# Altium schematic sheet Sheet1.SchDoc
size 381 x 241 mm; SheetNumber: 1; SheetTotal: 1
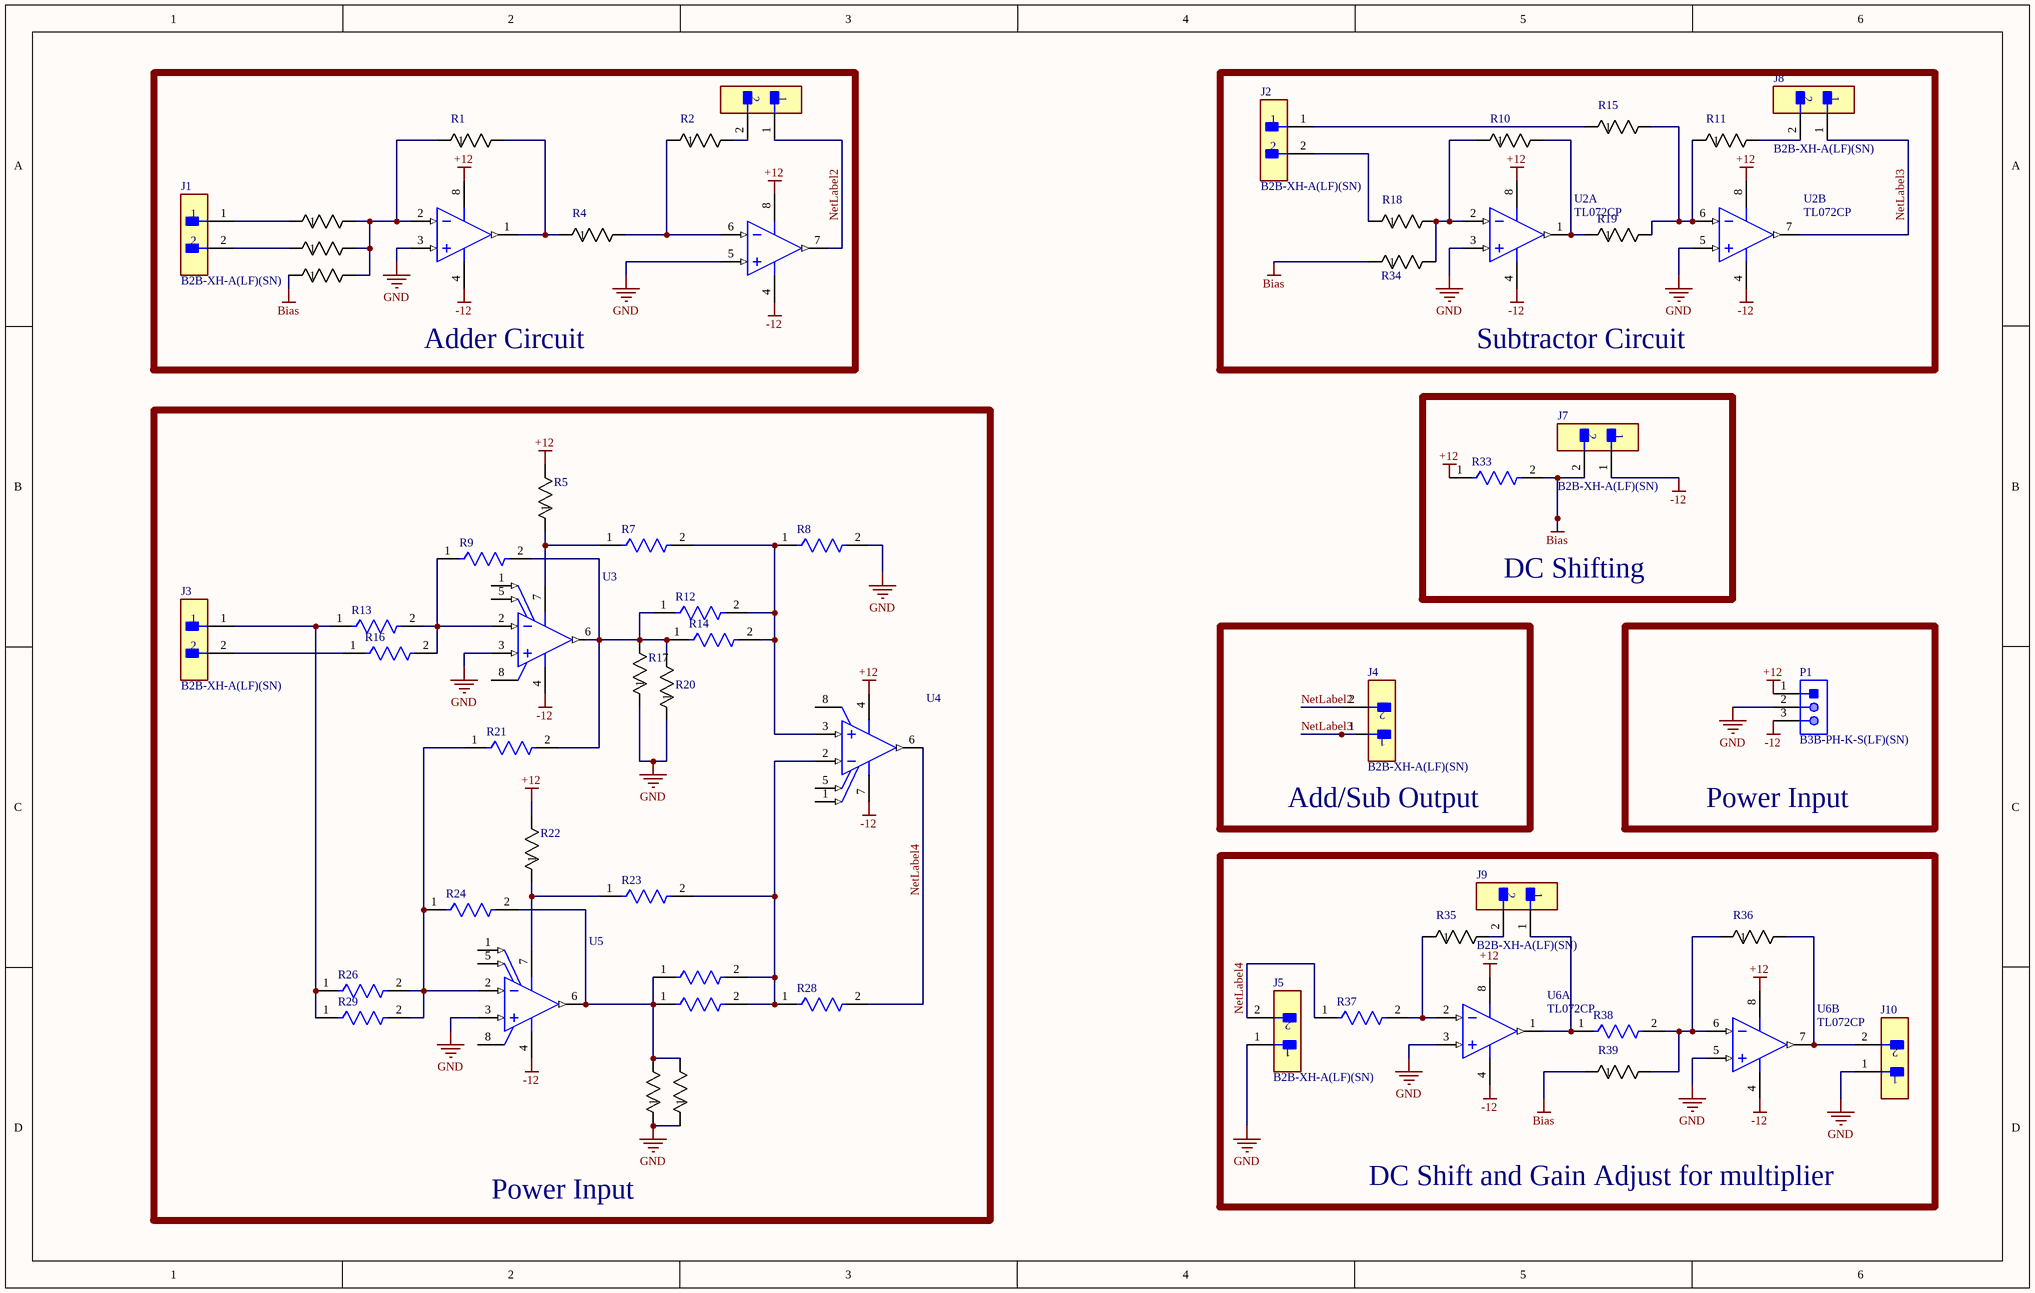
[diagram p0: Sheet1.SchDoc]

## Parts
J1  B2B-XH-A(LF)(SN)  [FP-B2B-XH-A_LF_SN-MFG]
J2  B2B-XH-A(LF)(SN)  [FP-B2B-XH-A_LF_SN-MFG]
J3  B2B-XH-A(LF)(SN)  [FP-B2B-XH-A_LF_SN-MFG]
J4  B2B-XH-A(LF)(SN)  [FP-B2B-XH-A_LF_SN-MFG]
J5  B2B-XH-A(LF)(SN)  [FP-B2B-XH-A_LF_SN-MFG]
J6  B2B-XH-A(LF)(SN)  [FP-B2B-XH-A_LF_SN-MFG]  (value not drawn)
J7  B2B-XH-A(LF)(SN)  [FP-B2B-XH-A_LF_SN-MFG]
J8  B2B-XH-A(LF)(SN)  [FP-B2B-XH-A_LF_SN-MFG]
J9  B2B-XH-A(LF)(SN)  [FP-B2B-XH-A_LF_SN-MFG]
J10  B2B-XH-A(LF)(SN)  [FP-B2B-XH-A_LF_SN-MFG]  (value not drawn)
P1  B3B-PH-K-S(LF)(SN)  [JST-B3B-PH-K-S-3_V]
R1  AC03000004701JAC00  [RES_AC03_VIS]  (value not drawn)
R2  AC03000004701JAC00  [RES_AC03_VIS]  (value not drawn)
R3  AC03000004701JAC00  [RES_AC03_VIS]  (value not drawn)
R4  AC03000004701JAC00  [RES_AC03_VIS]  (value not drawn)
R5  AC03000002201JAC00  [RES_AC03_VIS]  (value not drawn)
R6  AC03000004701JAC00  [RES_AC03_VIS]  (value not drawn)
R7  PR02000201003JA100  [FP-PR02000201003JA100-MFG]  (value not drawn)
R8  PR02000201003JA100  [FP-PR02000201003JA100-MFG]  (value not drawn)
R9  PR02000201003JA100  [FP-PR02000201003JA100-MFG]  (value not drawn)
R10  AC03000004701JAC00  [RES_AC03_VIS]  (value not drawn)
R11  AC03000004701JAC00  [RES_AC03_VIS]  (value not drawn)
R12  PR02000201003JA100  [FP-PR02000201003JA100-MFG]  (value not drawn)
R13  PR02000201003JA100  [FP-PR02000201003JA100-MFG]  (value not drawn)
R14  PR02000201003JA100  [FP-PR02000201003JA100-MFG]  (value not drawn)
R15  AC03000004701JAC00  [RES_AC03_VIS]  (value not drawn)
R16  PR02000201003JA100  [FP-PR02000201003JA100-MFG]  (value not drawn)
R17  AC03000004701JAC00  [RES_AC03_VIS]  (value not drawn)
R18  AC03000004701JAC00  [RES_AC03_VIS]  (value not drawn)
R19  AC03000004701JAC00  [RES_AC03_VIS]  (value not drawn)
R20  AC03000004701JAC00  [RES_AC03_VIS]  (value not drawn)
R21  PR02000201003JA100  [FP-PR02000201003JA100-MFG]  (value not drawn)
R22  AC03000002201JAC00  [RES_AC03_VIS]  (value not drawn)
R23  PR02000201003JA100  [FP-PR02000201003JA100-MFG]  (value not drawn)
R24  PR02000201003JA100  [FP-PR02000201003JA100-MFG]  (value not drawn)
R25  PR02000201003JA100  [FP-PR02000201003JA100-MFG]  (value not drawn)
R26  PR02000201003JA100  [FP-PR02000201003JA100-MFG]  (value not drawn)
R27  PR02000201003JA100  [FP-PR02000201003JA100-MFG]  (value not drawn)
R28  PR02000201003JA100  [FP-PR02000201003JA100-MFG]  (value not drawn)
R29  PR02000201003JA100  [FP-PR02000201003JA100-MFG]  (value not drawn)
R30  AC03000004701JAC00  [RES_AC03_VIS]  (value not drawn)
R31  AC03000004701JAC00  [RES_AC03_VIS]  (value not drawn)
R32  AC03000004701JAC00  [RES_AC03_VIS]  (value not drawn)
R33  PR02000201003JA100  [FP-PR02000201003JA100-MFG]  (value not drawn)
R34  AC03000004701JAC00  [RES_AC03_VIS]  (value not drawn)
R35  AC03000004701JAC00  [RES_AC03_VIS]  (value not drawn)
R36  AC03000004701JAC00  [RES_AC03_VIS]  (value not drawn)
R37  PR02000201003JA100  [FP-PR02000201003JA100-MFG]  (value not drawn)
R38  PR02000201003JA100  [FP-PR02000201003JA100-MFG]  (value not drawn)
R39  AC03000004701JAC00  [RES_AC03_VIS]  (value not drawn)
U1  TL072CP  [P0008A]  (value not drawn)  (parts A,B of 2)
U2  TL072CP  [P0008A]  (parts A,B of 2)
U3  UA741CP  [P0008A]  (value not drawn)
U4  UA741CP  [P0008A]  (value not drawn)
U5  UA741CP  [P0008A]  (value not drawn)
U6  TL072CP  [P0008A]  (parts A,B of 2)

## Blocks framed on the sheet
Adder Circuit: J1 J6 R1-R4 R6 R32 U1
Subtractor Circuit: J2 J8 R10 R11 R15 R18 R19 R34 U2
Power Input: J3 R5 R7-R9 R12-R14 R16 R17 R20-R31 U3-U5
DC Shifting: J7 R33
Add/Sub Output: J4
Power Input: P1
DC Shift and Gain Adjust for multiplier: J5 J9 J10 R35-R39 U6

## Nets
+12: P1.1 R5.2 R22.2 R33.1 U1.8(VCC+) U2.8(VCC+) U4.4(VCC-) U6.8(VCC+)
-12: J7.1 P1.3 U1.4(VCC-) U2.4(VCC-) U3.4(VCC-) U4.7(VCC+) U5.4(VCC-) U6.4(VCC-)
Bias: J7.2 R32.1 R33.2 R34.1 R39.1
GND: J5.1 J10.1 P1.2 R8.2 R17.1 R20.1 R30.1 R31.1 U1.3(IN1+) U1.5(IN2+) U2.3(IN1+) U2.5(IN2+) U3.3(IN+) U5.3(IN+) U6.3(IN1+) U6.5(IN2+)
NetLabel2: J4.2 J6.1 U1.7(OUT2)
NetLabel3: J4.1 J8.1 U2.7(OUT2)
NetLabel4: J5.2 R28.2 R37.1 U4.6(OUT)
NetJ1_1: J1.1 R3.1
NetJ1_2: J1.2 R6.1
NetJ2_1: J2.1 R15.1
NetJ2_2: J2.2 R18.1
NetJ3_1: J3.1 R13.1 R26.1 R29.1
NetJ3_2: J3.2 R16.1
NetJ6_2: J6.2 R2.2
NetJ8_2: J8.2 R11.2
NetJ9_1: J9.1 R38.1 U6.1(OUT1)
NetJ9_2: J9.2 R35.2
NetJ10_2: J10.2 R36.2 U6.7(OUT2)
NetR1_1: R1.1 R3.2 R6.2 R32.2 U1.2(IN1-)
NetR1_2: R1.2 R4.1 U1.1(OUT1)
NetR2_1: R2.1 R4.2 U1.6(IN2-)
NetR5_1: R5.1 R7.1 U3.7(VCC+)
NetR7_2: R7.2 R8.1 R12.2 R14.2 U4.3(IN+)
NetR9_1: R9.1 R13.2 R16.2 U3.2(IN-)
NetR9_2: R9.2 R12.1 R14.1 R17.2 R20.2 R21.2 U3.6(OUT)
NetR10_1: R10.1 R18.2 R34.2 U2.2(IN1-)
NetR10_2: R10.2 R19.1 U2.1(OUT1)
NetR11_1: R11.1 R15.2 R19.2 U2.6(IN2-)
NetR21_1: R21.1 R24.1 R26.2 R29.2 U5.2(IN-)
NetR22_1: R22.1 R23.1 U5.7(VCC+)
NetR23_2: R23.2 R25.2 R27.2 R28.1 U4.2(IN-)
NetR24_2: R24.2 R25.1 R27.1 R30.2 R31.2 U5.6(OUT)
NetR35_1: R35.1 R37.2 U6.2(IN1-)
NetR36_1: R36.1 R38.2 R39.2 U6.6(IN2-)

Not connected (* = marked no-connect by the designer): U3 1(OFFSET_N1) 5(OFFSET_N2) 8(NC); U4 1(OFFSET_N1) 5(OFFSET_N2) 8(NC); U5 1(OFFSET_N1) 5(OFFSET_N2) 8(NC)

## Library data of the parts
J1-J10 = CMP-2000-05888-3: CONN HEADER VERT 2POS 2.5MM; Current Rating: 3A; Voltage Rating: 250V; Number of Contacts: 2; Contact Resistance: 20mR; Wire/Cable Gauge: 22AWG; Insulation Resistance: 1GR; Connector Type: Male Pin; Packaging: Bulk; Contact Material: Brass; Lead Free: Lead Free; Orientation: Straight; Contact Plating: Tin; Max Current Rating: 3A; Termination: Solder; Fastening Type: Detent; Depth: 5.75mm; Housing Material: Polyamide; REACH SVHC: No SVHC; Series: XH; Voltage Rating (AC): 250V; Number of Positions: 2; Color: Natural; Contact Type: Male Pin; Max Voltage Rating (DC): 250V; Pitch: 2.5mm; Lead Pitch: 2.5mm; Mount: Through Hole; Max Operating Temperature: 85°C; Length: 7.4mm; Max Voltage Rating (AC): 250V; Min Operating Temperature: -25°C; Number of Rows: 1; Housing Color: White
P1 = CMP-2000-05164-1: Male Header, Pitch 2 mm, 1 x 3 Position, Height 6 mm, Tail Length 3.4 mm, -25 to 85 degC, RoHS, Bulk; Manufacturer: JST; Style/Orientation: StraightHeader/Plug; Pitch: 2mm; No of Positions: 3; Termination: Crimp; Manufacturer URL: http://www.jst.com/home2.html; Datasheet Version: Oct-06; Type: ShroudedHeader; Datasheet URL: https://datasheet.ciiva.com/11746/0900766b80826550-11746939.pdf
R1-R4 R6 R10 R11 R15 R17-R20 R30-R32 R34-R36 R39 = CMP-00030-42521947-1: AC03000004701JAC00 Fixed Resistor, Wire Wound, 3W, 4700ohm, 5% +/-Tol, 100ppm/Cel, Through Hole Mount; Temperature Coefficient: 100ppm/°C; Resistance: 4.7kΩ; Lead Diameter: 800µm; Voltage Rating (DC): 118V; Packaging: Cut Tape (CT); RoHS: Compliant; Composition: Wirewound; Military Standard: Not; Length: 13mm; Radiation Hardening: No; Number of Terminations: 2; Min Operating Temperature: -40°C; REACH SVHC: Unknown; Case/Package: Axial; Tolerance: 5%; Max Power Dissipation: 3W; Max Operating Temperature: 275°C; Features: Flame Retardant Coating; Termination: Axial; Width: 4.8mm; NexarPartId: 42521947; Power Rating: 3W; Number of Pins: 2; Lead Free: Lead Free; Diameter: 4.8mm; Contact Plating: Tin
R5 R22 = CMP-00030-39746899-1: AC03000002201JAC00 Resistor, 2.2 kOhm, ± 5%, 3 W, Axial Leaded, Wirewound, General Purpose; Temperature Coefficient: 180ppm/°C; Power Rating: 3W; Resistance: 2.2kΩ; Voltage Rating (DC): 81V; Lead Diameter: 800µm; Radiation Hardening: No; Case/Package: Axial; Length: 13mm; Number of Terminations: 2; Min Operating Temperature: 0°C; RoHS: Compliant; REACH SVHC: Unknown; Tolerance: 5%; Features: Flame Retardant Coating; Max Operating Temperature: 275°C; Contact Plating: Tin; Number of Pins: 2; Termination: Axial; Schedule B: 8533210080, 8533210080; Military Standard: Not; Width: 4.8mm; Diameter: 4.8mm; Composition: Wirewound; Max Power Dissipation: 3W; NexarPartId: 39746899; Packaging: Tape & Box (TB)
R7-R9 R12-R14 R16 R21 R23-R29 R33 R37 R38 = CMP-00030-42817933-1: PR02000201003JA100 Fixed Resistor, Metal Film, 2W, 100000ohm, 500V, 5% +/-Tol, 250ppm/Cel, Through Hole Mount; Resistance: 100kΩ; Temperature Coefficient: 250ppm/°C; Case/Package: Conformal; Lead Free: Lead Free; Composition: Metal Film; Schedule B: 8533210090, 8533210090; Tolerance: 5%; RoHS: Compliant; Min Operating Temperature: -55°C; NexarPartId: 42817933; Diameter: 3.9mm; Max Operating Temperature: 155°C; Voltage Rating: 500V; Length: 12mm; Width: 3.9mm; Contact Plating: Tin; REACH SVHC: No SVHC; Operating Supply Voltage: 500V; Termination: Axial; Power Rating: 2W; Military Standard: Not; Radiation Hardening: No; Mount: Through Hole; Voltage Rating (DC): 500V
U1 U2 U6 = CMP-0017-00950-2: Dual Low-Noise JFET-Input General-Purpose Operational Amplifier, 7 to 36 V, 0 to 70 degC, 8-pin DIP (P8), Pb-Free (RoHS); Manufacturer: Texas Instruments; Sub Family: General Purpose Amplifier, High Supply Voltage Amplifier (>=30V); Total Supply Voltage(Max)(+5V is 5, +/-5V is 10): 36; Slew Rate(Typ)(V/us): 13; Vn at 1kHz(Typ)(nV/rtHz): 18; GBW(Typ)(MHz): 3; CMRR(Min)(dB): 70; Total Supply Voltage(Min)(+5V is 5, +/-5V is 10): 7; Vio (25C)(Max)(mV): 10; Rating: Catalog; IIB(Max)(pA): 200; Iq per channel(Max)(mA): 2.5; Number of Channels: 2; Mounting Technology: Through Hole; ComponentLink3Description: Package Specification; PartNumber: TL072CP; PackageVersion: 4040082/E, 04/2010; Eco-Plan: Pb-Free (RoHS); DatasheetVersion: SLOS080J; Offset Drift(Typ)(uV/C): 18; ComponentLink3URL: http://www.ti.com/litv/pdf/mpdi001b; PackageDescription: 8-Pin Plastic In-Line, Body 9.59 x 6.35 mm, Pitch 2.54 mm; Code_JEDEC: MS-001; ComponentLink2URL: http://www.ti.com/lit/ds/symlink/tl072.pdf; ComponentLink1Description: Manufacturer URL; ComponentLink2Description: Datasheet; ComponentLink1URL: http://www.ti.com/; PackageReference: P0008A
U3-U5 = CMP-0017-00973-2: General-Purpose Operational Amplifier, 7 to 36 V, 0 to 70 degC, 8-pin DIP (P8), Pb-Free (RoHS); Manufacturer: Texas Instruments; Iq per channel(Max)(mA): 2.8; Number of Channels: 1; Total Supply Voltage(Min)(+5V is 5, +/-5V is 10): 7; IIB(Max)(pA): 800000; Slew Rate(Typ)(V/us): 0.5; Total Supply Voltage(Max)(+5V is 5, +/-5V is 10): 36; Vio (25C)(Max)(mV): 6; CMRR(Min)(dB): 70; Sub Family: General Purpose Amplifier, High Supply Voltage Amplifier (>=30V); PackageVersion: 4040082/E, 04/2010; PackageReference: P0008A; ComponentLink1URL: http://www.ti.com/; Mounting Technology: Through Hole; ComponentLink1Description: Manufacturer URL; GBW(Typ)(MHz): 1; ComponentLink2Description: Datasheet; ComponentLink2URL: http://www.ti.com/lit/ds/symlink/ua741.pdf; PartNumber: UA741CP; Code_JEDEC: MS-001; ComponentLink3Description: Package Specification; DatasheetVersion: SLOS094B; ComponentLink3URL: http://www.ti.com/litv/pdf/mpdi001b; PackageDescription: 8-Pin Plastic In-Line, Body 9.59 x 6.35 mm, Pitch 2.54 mm; Eco-Plan: Pb-Free (RoHS)